# EAGLE schematic shield-p1000_v53 (EAGLE 9.7.0)
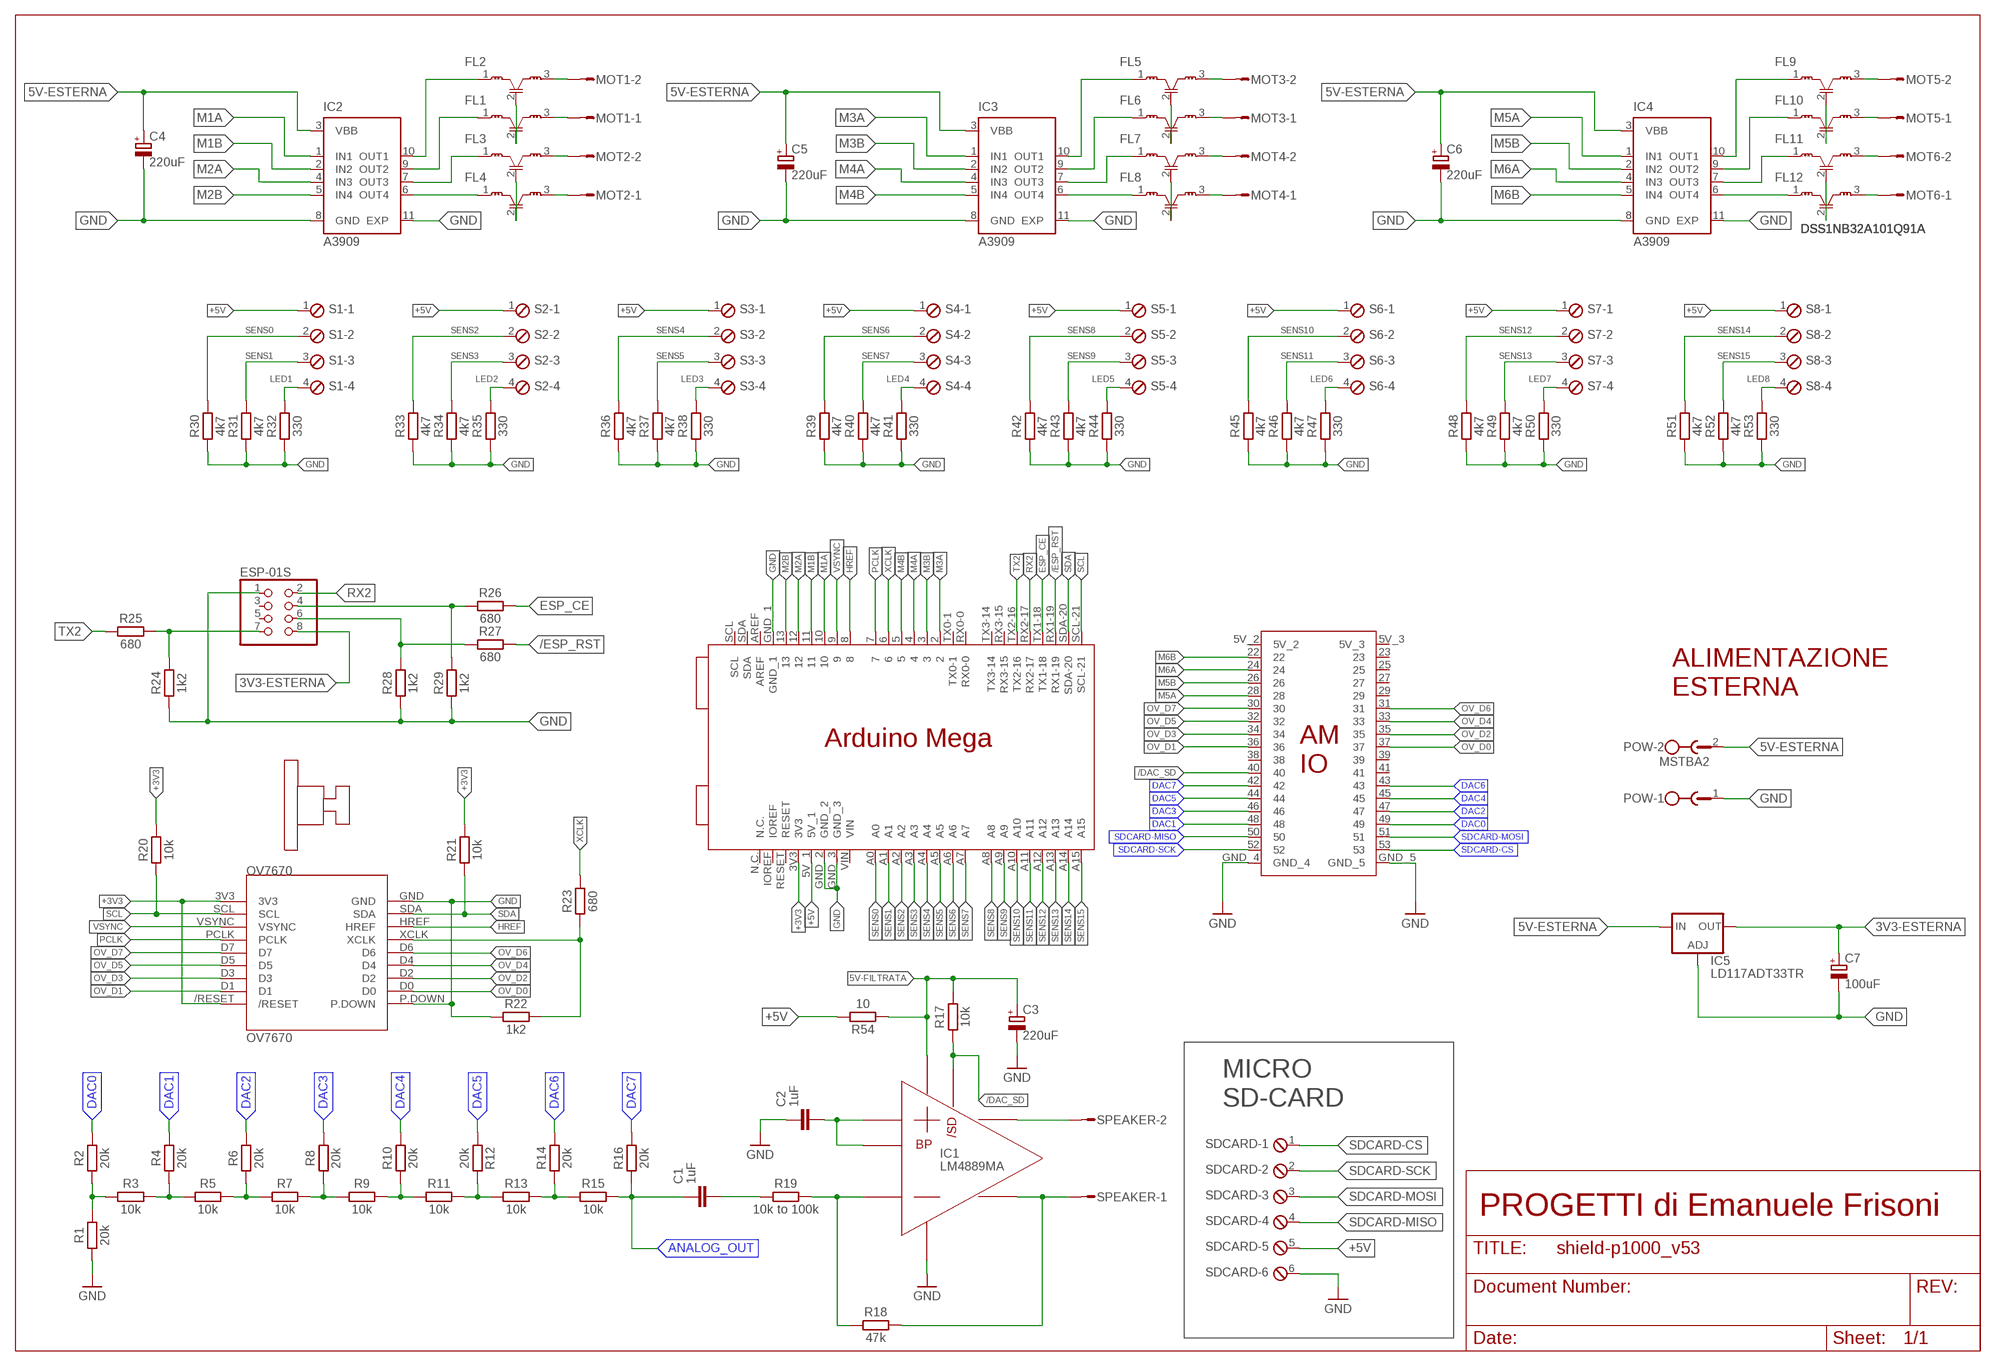
[diagram p0: schematic, sheet 1]

## Parts
ARDUINO-MEGA1  ARDUINO-MEGA-SH  [ARDUINO-MEGA-SH]
C1  1uF  C_CHIP-0603(1608-METRIC)  [CAPC1608X85]
C2  1uF  C_CHIP-0603(1608-METRIC)  [CAPC1608X85]
C3  220uF  CPOL-EUE3.5-10  [E3,5-10]
C4  220uF  CPOL-EUE3.5-10  [E3,5-10]
C5  220uF  CPOL-EUE3.5-10  [E3,5-10]
C6  220uF  CPOL-EUE3.5-10  [E3,5-10]
C7  100uF  CPOL-EUE3.5-10  [E3,5-10]
ESP-01S  PINHD-2X4  [2X04]
FL1  DSS1NB32A101Q91A  [RADIAL-3]
FL2  DSS1NB32A101Q91A  [RADIAL-3]
FL3  DSS1NB32A101Q91A  [RADIAL-3]
FL4  DSS1NB32A101Q91A  [RADIAL-3]
FL5  DSS1NB32A101Q91A  [RADIAL-3]
FL6  DSS1NB32A101Q91A  [RADIAL-3]
FL7  DSS1NB32A101Q91A  [RADIAL-3]
FL8  DSS1NB32A101Q91A  [RADIAL-3]
FL9  DSS1NB32A101Q91A  [RADIAL-3]
FL10  DSS1NB32A101Q91A  [RADIAL-3]
FL11  DSS1NB32A101Q91A  [RADIAL-3]
FL12  DSS1NB32A101Q91A  [RADIAL-3]
IC1  LM4889MA  [SOIC127P599X175-8N]
IC2  A3909  A3909LY  [10-MSOP]
IC3  A3909  A3909LY  [10-MSOP]
IC4  A3909  A3909LY  [10-MSOP]
IC5  LD117ADT33TR  [DPACK]
MOT1  S02P  [S02P]
MOT2  S02P  [S02P]
MOT3  S02P  [S02P]
MOT4  S02P  [S02P]
MOT5  S02P  [S02P]
MOT6  S02P  [S02P]
OV7670  OV7670  [OV7670-HEADER]
POW  MSTBA2  [MSTBA2]
R1  20k  R_CHIP-0603(1608-METRIC)  [RESC1608X60]
R2  20k  R_CHIP-0603(1608-METRIC)  [RESC1608X60]
R3  10k  R_CHIP-0603(1608-METRIC)  [RESC1608X60]
R4  20k  R_CHIP-0603(1608-METRIC)  [RESC1608X60]
R5  10k  R_CHIP-0603(1608-METRIC)  [RESC1608X60]
R6  20k  R_CHIP-0603(1608-METRIC)  [RESC1608X60]
R7  10k  R_CHIP-0603(1608-METRIC)  [RESC1608X60]
R8  20k  R_CHIP-0603(1608-METRIC)  [RESC1608X60]
R9  10k  R_CHIP-0603(1608-METRIC)  [RESC1608X60]
R10  20k  R_CHIP-0603(1608-METRIC)  [RESC1608X60]
R11  10k  R_CHIP-0603(1608-METRIC)  [RESC1608X60]
R12  20k  R_CHIP-0603(1608-METRIC)  [RESC1608X60]
R13  10k  R_CHIP-0603(1608-METRIC)  [RESC1608X60]
R14  20k  R_CHIP-0603(1608-METRIC)  [RESC1608X60]
R15  10k  R_CHIP-0603(1608-METRIC)  [RESC1608X60]
R16  20k  R_CHIP-0603(1608-METRIC)  [RESC1608X60]
R17  10k  R_CHIP-0603(1608-METRIC)  [RESC1608X60]
R18  47k  R_CHIP-0603(1608-METRIC)  [RESC1608X60]
R19  10k to 100k  R_AXIAL-7.2MM-PITCH  [RESAD724W46L381D178B]
R20  10k  R_CHIP-0603(1608-METRIC)  [RESC1608X60]
R21  10k  R_CHIP-0603(1608-METRIC)  [RESC1608X60]
R22  1k2  R_CHIP-0603(1608-METRIC)  [RESC1608X60]
R23  680  R_CHIP-0603(1608-METRIC)  [RESC1608X60]
R24  1k2  R_CHIP-0603(1608-METRIC)  [RESC1608X60]
R25  680  R_CHIP-0603(1608-METRIC)  [RESC1608X60]
R26  680  R_CHIP-0603(1608-METRIC)  [RESC1608X60]
R27  680  R_CHIP-0603(1608-METRIC)  [RESC1608X60]
R28  1k2  R_CHIP-0603(1608-METRIC)  [RESC1608X60]
R29  1k2  R_CHIP-0603(1608-METRIC)  [RESC1608X60]
R30  4k7  R_CHIP-0603(1608-METRIC)  [RESC1608X60]
R31  4k7  R_CHIP-0603(1608-METRIC)  [RESC1608X60]
R32  330  R_CHIP-0603(1608-METRIC)  [RESC1608X60]
R33  4k7  R_CHIP-0603(1608-METRIC)  [RESC1608X60]
R34  4k7  R_CHIP-0603(1608-METRIC)  [RESC1608X60]
R35  330  R_CHIP-0603(1608-METRIC)  [RESC1608X60]
R36  4k7  R_CHIP-0603(1608-METRIC)  [RESC1608X60]
R37  4k7  R_CHIP-0603(1608-METRIC)  [RESC1608X60]
R38  330  R_CHIP-0603(1608-METRIC)  [RESC1608X60]
R39  4k7  R_CHIP-0603(1608-METRIC)  [RESC1608X60]
R40  4k7  R_CHIP-0603(1608-METRIC)  [RESC1608X60]
R41  330  R_CHIP-0603(1608-METRIC)  [RESC1608X60]
R42  4k7  R_CHIP-0603(1608-METRIC)  [RESC1608X60]
R43  4k7  R_CHIP-0603(1608-METRIC)  [RESC1608X60]
R44  330  R_CHIP-0603(1608-METRIC)  [RESC1608X60]
R45  4k7  R_CHIP-0603(1608-METRIC)  [RESC1608X60]
R46  4k7  R_CHIP-0603(1608-METRIC)  [RESC1608X60]
R47  330  R_CHIP-0603(1608-METRIC)  [RESC1608X60]
R48  4k7  R_CHIP-0603(1608-METRIC)  [RESC1608X60]
R49  4k7  R_CHIP-0603(1608-METRIC)  [RESC1608X60]
R50  330  R_CHIP-0603(1608-METRIC)  [RESC1608X60]
R51  4k7  R_CHIP-0603(1608-METRIC)  [RESC1608X60]
R52  4k7  R_CHIP-0603(1608-METRIC)  [RESC1608X60]
R53  330  R_CHIP-0603(1608-METRIC)  [RESC1608X60]
R54  10  R_CHIP-0603(1608-METRIC)  [RESC1608X60]
S1  MPT4  [4POL254]
S2  MPT4  [4POL254]
S3  MPT4  [4POL254]
S4  MPT4  [4POL254]
S5  MPT4  [4POL254]
S6  MPT4  [4POL254]
S7  MPT4  [4POL254]
S8  MPT4  [4POL254]
SDCARD  MPT6  [6POL254]
SPEAKER  S02P  [S02P]

## Nets
3V3-ESTERNA: C7.+ ESP-01S.8 IC5.4(OUT)
5V-ESTERNA: C4.+ C5.+ C6.+ IC2.3(VBB) IC3.3(VBB) IC4.3(VBB) IC5.3(IN) POW.2
5V-FILTRATA: C3.+ IC1.6(VDD) R17.1 R54.2
+3V3: ARDUINO-MEGA1.3V3 OV7670.3V3 OV7670./RESET R20.2 R21.2
+5V: ARDUINO-MEGA1.5V_1 R54.1 S1.1 S2.1 S3.1 S4.1 S5.1 S6.1 S7.1 S8.1 SDCARD.5
/DAC_SD: ARDUINO-MEGA1.40 IC1.1(/SHUTDOWN) R17.2
/ESP_RST: ARDUINO-MEGA1.RX1-19 R27.2
ANALOG_OUT: C1.1 R15.1 R16.2
DAC0: ARDUINO-MEGA1.49 R2.1
DAC1: ARDUINO-MEGA1.48 R4.1
DAC2: ARDUINO-MEGA1.47 R6.1
DAC3: ARDUINO-MEGA1.46 R8.1
DAC4: ARDUINO-MEGA1.45 R10.1
DAC5: ARDUINO-MEGA1.44 R12.1
DAC6: ARDUINO-MEGA1.43 R14.1
DAC7: ARDUINO-MEGA1.42 R16.1
ESP_CE: ARDUINO-MEGA1.TX1-18 R26.2
GND: ARDUINO-MEGA1.GND_1 ARDUINO-MEGA1.GND_2 ARDUINO-MEGA1.GND_3 ARDUINO-MEGA1.GND_4 ARDUINO-MEGA1.GND_5 C2.1 C3.- C4.- C5.- C6.- C7.- ESP-01S.1 IC1.7(VSS) IC2.8(GND) IC2.11(EXP) IC3.8(GND) IC3.11(EXP) IC4.8(GND) IC4.11(EXP) IC5.1(ADJ) OV7670.GND OV7670.P.DOWN POW.1 R1.1 R22.1 R24.1 R28.1 R29.1 R30.1 R31.1 R32.1 R33.1 R34.1 R35.1 R36.1 R37.1 R38.1 R39.1 R40.1 R41.1 R42.1 R43.1 R44.1 R45.1 R46.1 R47.1 R48.1 R49.1 R50.1 R51.1 R52.1 R53.1 SDCARD.6
HREF: ARDUINO-MEGA1.8 OV7670.HREF
LED1: R32.2 S1.4
LED2: R35.2 S2.4
LED3: R38.2 S3.4
LED4: R41.2 S4.4
LED5: R44.2 S5.4
LED6: R47.2 S6.4
LED7: R50.2 S7.4
LED8: R53.2 S8.4
M1A: ARDUINO-MEGA1.10 IC2.1(IN1)
M1B: ARDUINO-MEGA1.11 IC2.2(IN2)
M2A: ARDUINO-MEGA1.12 IC2.4(IN3)
M2B: ARDUINO-MEGA1.13 IC2.5(IN4)
M3A: ARDUINO-MEGA1.2 IC3.1(IN1)
M3B: ARDUINO-MEGA1.3 IC3.2(IN2)
M4A: ARDUINO-MEGA1.4 IC3.4(IN3)
M4B: ARDUINO-MEGA1.5 IC3.5(IN4)
M5A: ARDUINO-MEGA1.28 IC4.1(IN1)
M5B: ARDUINO-MEGA1.26 IC4.2(IN2)
M6A: ARDUINO-MEGA1.24 IC4.4(IN3)
M6B: ARDUINO-MEGA1.22 IC4.5(IN4)
N$1: R1.2 R2.2 R3.2
N$2: R3.1 R4.2 R5.2
N$3: R5.1 R6.2 R7.2
N$4: R7.1 R8.2 R9.2
N$5: R9.1 R10.2 R11.2
N$6: R11.1 R12.2 R13.2
N$7: R13.1 R14.2 R15.2
N$8: IC1.8(VO2) SPEAKER.2
N$9: FL4.1 IC2.6(OUT4)
N$10: C1.2 R19.1
N$11: IC1.4(IN-) R18.2 R19.2
N$12: IC1.5(VO1) R18.1 SPEAKER.1
N$13: C2.2 IC1.2(BYPASS) IC1.3(IN+)
N$14: ESP-01S.7 R24.2 R25.2
N$15: ESP-01S.4 R26.1 R29.2
N$16: ESP-01S.6 R27.1 R28.2
N$17: FL3.1 IC2.7(OUT3)
N$18: FL1.1 IC2.9(OUT2)
N$19: FL2.1 IC2.10(OUT1)
N$20: FL2.3 MOT1.2
N$21: FL1.3 MOT1.1
N$22: FL3.3 MOT2.2
N$23: FL4.3 MOT2.1
N$24: FL8.1 IC3.6(OUT4)
N$25: FL7.1 IC3.7(OUT3)
N$26: FL6.1 IC3.9(OUT2)
N$27: FL5.1 IC3.10(OUT1)
N$28: FL5.3 MOT3.2
N$29: FL6.3 MOT3.1
N$30: FL7.3 MOT4.2
N$31: FL8.3 MOT4.1
N$32: FL12.1 IC4.6(OUT4)
N$33: FL11.1 IC4.7(OUT3)
N$34: FL10.1 IC4.9(OUT2)
N$35: FL9.1 IC4.10(OUT1)
N$36: FL9.3 MOT5.2
N$37: FL10.3 MOT5.1
N$38: FL11.3 MOT6.2
N$39: FL12.3 MOT6.1
N$40: FL1.2(GND) FL2.2(GND)
N$41: FL3.2(GND) FL4.2(GND)
N$42: FL5.2(GND) FL6.2(GND)
N$43: FL7.2(GND) FL8.2(GND)
N$44: FL9.2(GND) FL10.2(GND)
N$45: FL11.2(GND) FL12.2(GND)
OV_D0: ARDUINO-MEGA1.37 OV7670.D0
OV_D1: ARDUINO-MEGA1.36 OV7670.D1
OV_D2: ARDUINO-MEGA1.35 OV7670.D2
OV_D3: ARDUINO-MEGA1.34 OV7670.D3
OV_D4: ARDUINO-MEGA1.33 OV7670.D4
OV_D5: ARDUINO-MEGA1.32 OV7670.D5
OV_D6: ARDUINO-MEGA1.31 OV7670.D6
OV_D7: ARDUINO-MEGA1.30 OV7670.D7
PCLK: ARDUINO-MEGA1.7 OV7670.PCLK
RX2: ARDUINO-MEGA1.RX2-17 ESP-01S.2
SCL: ARDUINO-MEGA1.SCL-21 OV7670.SCL R20.1
SDA: ARDUINO-MEGA1.SDA-20 OV7670.SDA R21.1
SDCARD-CS: ARDUINO-MEGA1.53 SDCARD.1
SDCARD-MISO: ARDUINO-MEGA1.50 SDCARD.4
SDCARD-MOSI: ARDUINO-MEGA1.51 SDCARD.3
SDCARD-SCK: ARDUINO-MEGA1.52 SDCARD.2
SENS0: ARDUINO-MEGA1.A0 R30.2 S1.2
SENS1: ARDUINO-MEGA1.A1 R31.2 S1.3
SENS2: ARDUINO-MEGA1.A2 R33.2 S2.2
SENS3: ARDUINO-MEGA1.A3 R34.2 S2.3
SENS4: ARDUINO-MEGA1.A4 R36.2 S3.2
SENS5: ARDUINO-MEGA1.A5 R37.2 S3.3
SENS6: ARDUINO-MEGA1.A6 R39.2 S4.2
SENS7: ARDUINO-MEGA1.A7 R40.2 S4.3
SENS8: ARDUINO-MEGA1.A8 R42.2 S5.2
SENS9: ARDUINO-MEGA1.A9 R43.2 S5.3
SENS10: ARDUINO-MEGA1.A10 R45.2 S6.2
SENS11: ARDUINO-MEGA1.A11 R46.2 S6.3
SENS12: ARDUINO-MEGA1.A12 R48.2 S7.2
SENS13: ARDUINO-MEGA1.A13 R49.2 S7.3
SENS14: ARDUINO-MEGA1.A14 R51.2 S8.2
SENS15: ARDUINO-MEGA1.A15 R52.2 S8.3
TX2: ARDUINO-MEGA1.TX2-16 R25.1
VSYNC: ARDUINO-MEGA1.9 OV7670.VSYNC
XCLK: ARDUINO-MEGA1.6 R23.2
XCLK1: OV7670.XCLK R22.2 R23.1
Unconnected: ARDUINO-MEGA1.5V_2 ARDUINO-MEGA1.5V_3 ARDUINO-MEGA1.23 ARDUINO-MEGA1.25 ARDUINO-MEGA1.27 ARDUINO-MEGA1.29 ARDUINO-MEGA1.38 ARDUINO-MEGA1.39 ARDUINO-MEGA1.41 ARDUINO-MEGA1.AREF ARDUINO-MEGA1.IOREF ARDUINO-MEGA1.N.C. ARDUINO-MEGA1.RESET ARDUINO-MEGA1.RX0-0 ARDUINO-MEGA1.RX3-15 ARDUINO-MEGA1.SCL ARDUINO-MEGA1.SDA ARDUINO-MEGA1.TX0-1 ARDUINO-MEGA1.TX3-14 ARDUINO-MEGA1.VIN ESP-01S.3 ESP-01S.5

## Notes on the sheet
- ALIMENTAZIONE
  ESTERNA
- MICRO
  SD-CARD
- PROGETTI di Emanuele Frisoni

## Library data of the parts
ARDUINO-MEGA1 = progetto1000:ARDUINO-MEGA-SH
C1 C2 = Capacitor:C: Capacitor - Generic; CATEGORY: Capacitor
C3-C7 = rcl:CPOL-EU: POLARIZED CAPACITOR, European symbol; SPICEPREFIX: C
ESP-01S = pinhead:PINHD-2X4: PIN HEADER
FL1-FL12 = Filters:DSS1NB32A101Q91A: FILTER LC(T) 100PF TH Manufacturer's datasheet <https://media.digikey.com/pdf/Data%20Sheets/Murata%20PDFs/DSS1NB3_Spec.pdf>; CREATED_BY: PCBLayout.com; DIGIKEY_PN: 490-9787-3-ND; MANUFACTURER: Murata Electronics; MPN: DSS1NB32A101Q91A; PACKAGE: RADIAL
IC1 = progetto1000:LM4889
IC2-IC4 = allegro:A3909
IC5 = v-reg:LD117A?*: Low drop fixed and adjustable positive voltage regulators 1 A Source: http://www.st.com/stonline/products/literature/ds/7194/ld1117axx.pdf
MOT1-MOT6 SPEAKER = con-amp-mt:S02P: AMP MT CONNECTOR; OC_FARNELL: unknown; OC_NEWARK: unknown
OV7670 = progetto1000:OV7670
POW = con-phoenix-508:MSTBA2: PHOENIX; MF: FARNELL; MPN: 1757242; OC_FARNELL: 3705171; OC_NEWARK: 71C4161
R1-R54 = Resistor:R: Resistor Fixed - Generic; CATEGORY: Resistor; SUB-CATEGORY: Fixed
S1-S8 = con-phoenix-254-custom:MPT4: PHOENIX CONNECTOR; OC_FARNELL: unknown; OC_NEWARK: unknown
SDCARD = con-phoenix-254:MPT6: PHOENIX CONNECTOR; OC_FARNELL: unknown; OC_NEWARK: unknown